# Altium schematic sheet ArmControl.SchDoc
size B; SheetNumber: 1; SheetTotal: 8
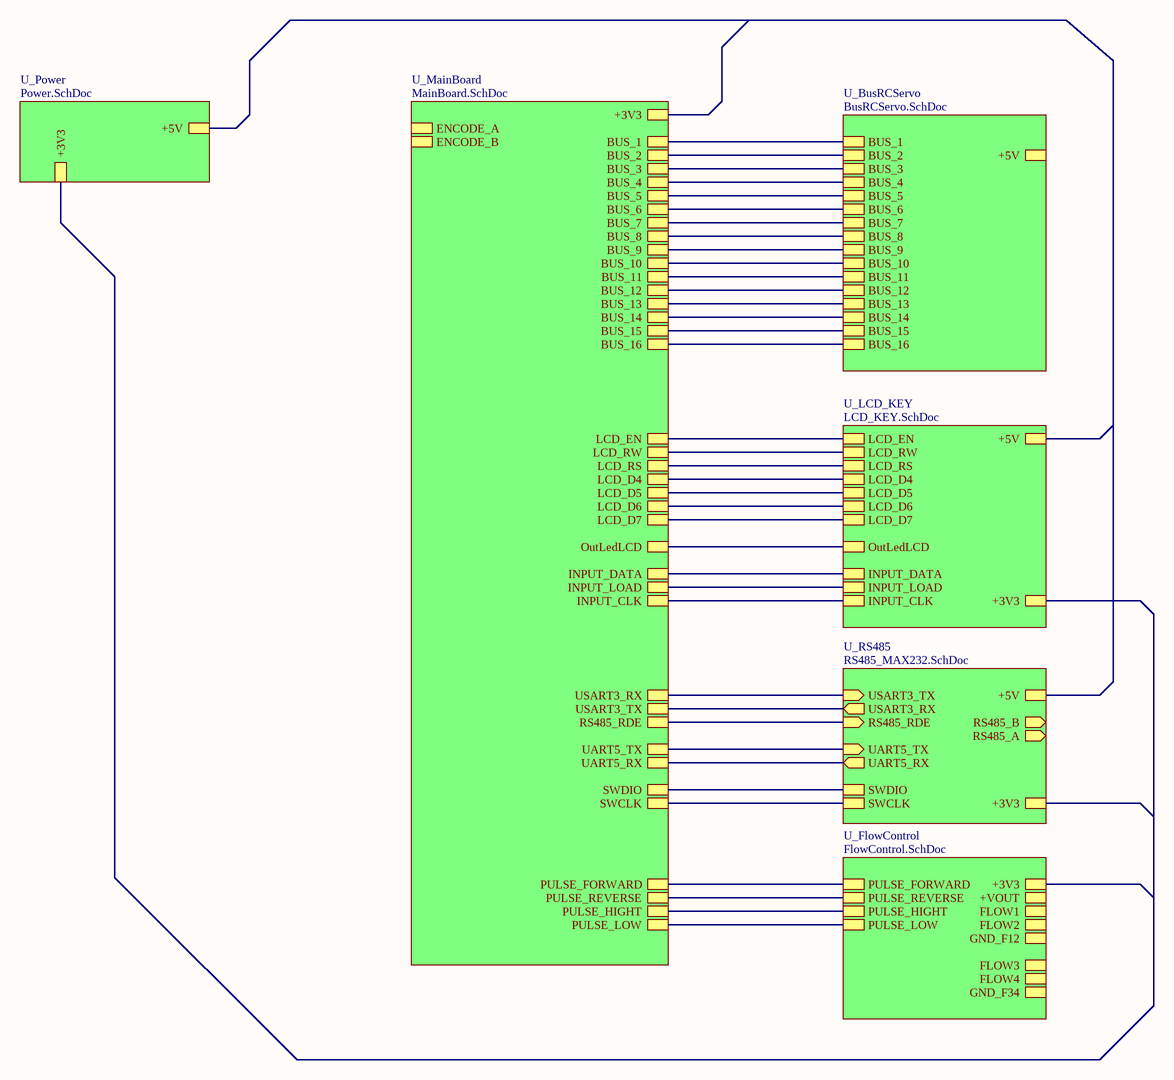
[diagram p0: ArmControl.SchDoc]

## Sub-sheets
U_BusRCServo = BusRCServo.SchDoc: BUS_1, BUS_2, BUS_3, BUS_4, BUS_5, BUS_6, BUS_7, BUS_8, BUS_9, BUS_10, BUS_11, BUS_12, BUS_13, BUS_14, BUS_15, BUS_16, +5V
U_FlowControl = FlowControl.SchDoc: +3V3, +VOUT, PULSE_FORWARD, FLOW2, GND_F12, FLOW1, PULSE_REVERSE, PULSE_HIGHT, FLOW4, GND_F34, FLOW3, PULSE_LOW
U_LCD_KEY = LCD_KEY.SchDoc: LCD_EN, LCD_RW, LCD_RS, LCD_D4, LCD_D5, LCD_D6, LCD_D7, +5V, OutLedLCD, +3V3, INPUT_DATA, INPUT_LOAD, INPUT_CLK
U_MainBoard = MainBoard.SchDoc: ENCODE_A, ENCODE_B, BUS_5, BUS_6, BUS_2, BUS_3, BUS_4, BUS_11, BUS_12, BUS_9, BUS_10, BUS_13, BUS_14, BUS_15, BUS_16, BUS_1, BUS_7, BUS_8, LCD_D4, LCD_D5, LCD_D6, LCD_D7, LCD_EN, LCD_RW, LCD_RS, INPUT_DATA, INPUT_LOAD, INPUT_CLK, SWDIO, SWCLK, +3V3, RS485_RDE, USART3_RX, USART3_TX, PULSE_LOW, OutLedLCD, PULSE_HIGHT, PULSE_REVERSE, PULSE_FORWARD, UART5_TX, UART5_RX
U_Power = Power.SchDoc: +3V3, +5V
U_RS485 = RS485_MAX232.SchDoc: USART3_RX (out), USART3_TX (in), RS485_A (out), RS485_B (out), RS485_RDE (in), +5V, SWCLK, UART5_RX (out), UART5_TX (in), SWDIO, +3V3

## Nets
(unnamed): sheet U_BusRCServo/BUS_1, sheet U_MainBoard/BUS_1
(unnamed): sheet U_BusRCServo/BUS_2, sheet U_MainBoard/BUS_2
(unnamed): sheet U_BusRCServo/BUS_3, sheet U_MainBoard/BUS_3
(unnamed): sheet U_BusRCServo/BUS_4, sheet U_MainBoard/BUS_4
(unnamed): sheet U_BusRCServo/BUS_5, sheet U_MainBoard/BUS_5
(unnamed): sheet U_BusRCServo/BUS_6, sheet U_MainBoard/BUS_6
(unnamed): sheet U_BusRCServo/BUS_7, sheet U_MainBoard/BUS_7
(unnamed): sheet U_BusRCServo/BUS_8, sheet U_MainBoard/BUS_8
(unnamed): sheet U_BusRCServo/BUS_9, sheet U_MainBoard/BUS_9
(unnamed): sheet U_BusRCServo/BUS_10, sheet U_MainBoard/BUS_10
(unnamed): sheet U_BusRCServo/BUS_11, sheet U_MainBoard/BUS_11
(unnamed): sheet U_BusRCServo/BUS_12, sheet U_MainBoard/BUS_12
(unnamed): sheet U_BusRCServo/BUS_13, sheet U_MainBoard/BUS_13
(unnamed): sheet U_BusRCServo/BUS_14, sheet U_MainBoard/BUS_14
(unnamed): sheet U_BusRCServo/BUS_15, sheet U_MainBoard/BUS_15
(unnamed): sheet U_BusRCServo/BUS_16, sheet U_MainBoard/BUS_16
(unnamed): sheet U_LCD_KEY/LCD_EN, sheet U_MainBoard/LCD_EN
(unnamed): sheet U_LCD_KEY/LCD_RW, sheet U_MainBoard/LCD_RW
(unnamed): sheet U_LCD_KEY/LCD_RS, sheet U_MainBoard/LCD_RS
(unnamed): sheet U_LCD_KEY/LCD_D4, sheet U_MainBoard/LCD_D4
(unnamed): sheet U_LCD_KEY/LCD_D5, sheet U_MainBoard/LCD_D5
(unnamed): sheet U_LCD_KEY/LCD_D6, sheet U_MainBoard/LCD_D6
(unnamed): sheet U_LCD_KEY/LCD_D7, sheet U_MainBoard/LCD_D7
(unnamed): sheet U_LCD_KEY/OutLedLCD, sheet U_MainBoard/OutLedLCD
(unnamed): sheet U_LCD_KEY/INPUT_DATA, sheet U_MainBoard/INPUT_DATA
(unnamed): sheet U_LCD_KEY/INPUT_LOAD, sheet U_MainBoard/INPUT_LOAD
(unnamed): sheet U_LCD_KEY/INPUT_CLK, sheet U_MainBoard/INPUT_CLK
(unnamed): sheet U_FlowControl/PULSE_FORWARD, sheet U_MainBoard/PULSE_FORWARD
(unnamed): sheet U_FlowControl/PULSE_REVERSE, sheet U_MainBoard/PULSE_REVERSE
(unnamed): sheet U_FlowControl/PULSE_HIGHT, sheet U_MainBoard/PULSE_HIGHT
(unnamed): sheet U_FlowControl/PULSE_LOW, sheet U_MainBoard/PULSE_LOW
(unnamed): sheet U_MainBoard/SWDIO, sheet U_RS485/SWDIO
(unnamed): sheet U_MainBoard/SWCLK, sheet U_RS485/SWCLK
(unnamed): sheet U_MainBoard/RS485_RDE, sheet U_RS485/RS485_RDE
(unnamed): sheet U_MainBoard/USART3_RX, sheet U_RS485/USART3_TX
(unnamed): sheet U_MainBoard/USART3_TX, sheet U_RS485/USART3_RX
(unnamed): sheet U_MainBoard/UART5_TX, sheet U_RS485/UART5_TX
(unnamed): sheet U_MainBoard/UART5_RX, sheet U_RS485/UART5_RX